# Altium schematic sheet beep.SchDoc
size A4
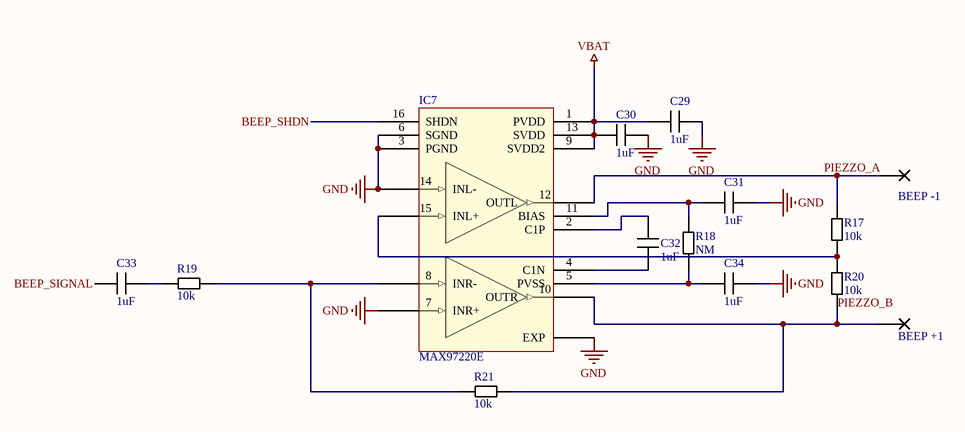
[diagram p0: beep.SchDoc]

## Parts
BEEP_+1  hole_0.8/0.5  [0.8 / 0.5]  (value not drawn)
BEEP_-1  hole_0.8/0.5  [0.8 / 0.5]  (value not drawn)
C29  value 1uF  [C0402]  (hidden comment: 1uF (0402))
C30  value 1uF  [C0402]  (hidden comment: 1uF (0402))
C31  value 1uF  [C0402]  (hidden comment: 1uF (0402))
C32  value 1uF  [C0402]  (hidden comment: 1uF (0402))
C33  value 1uF  [C0402]  (hidden comment: 1uF (0402))
C34  value 1uF  [C0402]  (hidden comment: 1uF (0402))
IC7  MAX97220E  [TQFN-16]
R17  value 10k  [R0402]  (hidden comment: 10k (0402))
R18  value NM  [R0402 (NM)]  (hidden comment: NM (0402))
R19  value 10k  [R0402]  (hidden comment: 10k (0402))
R20  value 10k  [R0402]  (hidden comment: 10k (0402))
R21  value 10k  [R0402]  (hidden comment: 10k (0402))

## Nets
GND: C29.2 C30.2 C31.2 C34.2 IC7.3(PGND) IC7.6(SGND) IC7.7(INR+) IC7.14(INL-) IC7.EXP
VBAT: C29.1 C30.1 IC7.1(PVDD) IC7.9(SVDD2) IC7.13(SVDD)
BEEP_SHDN: IC7.16(SHDN)
BEEP_SIGNAL: C33.1
PIEZZO_A: BEEP_-1.1 IC7.12(OUTL) R17.2
PIEZZO_B: BEEP_+1.1 IC7.10(OUTR) R20.1 R21.1
NetC31_1: C31.1 IC7.11(BIAS) R18.2
NetC32_1: C32.1 IC7.2(C1P)
NetC32_2: C32.2 IC7.4(C1N)
NetC33_2: C33.2 R19.2
NetC34_1: C34.1 IC7.5(PVSS) R18.1
NetIC7_8: IC7.8(INR-) R19.1 R21.2
NetIC7_15: IC7.15(INL+) R17.1 R20.2

## Library data of the parts
C29-C34 = 1uF (0402): X7S 10% 0402 16V; Fabricant: MURATA; Référence: GRM155C71C105KE11D
IC7 = MAX97220E: Differential Input DirectDrive / Line Drivers/Headphone Amplifiers; Fabricant: Maxim Integrated; Value: MAX97220E; Référence: MAX97220E
R17 R19-R21 = 10k (0402): 1% 0402 0.063W 100ppm; Référence: MCWR04X1002FTL; Fabricant: MULTICOMP
BEEP_+1 BEEP_-1 = hole_0.8/0.5: Value: *